# EAGLE schematic MainBoard 10-11 ver2 (EAGLE 5.10)
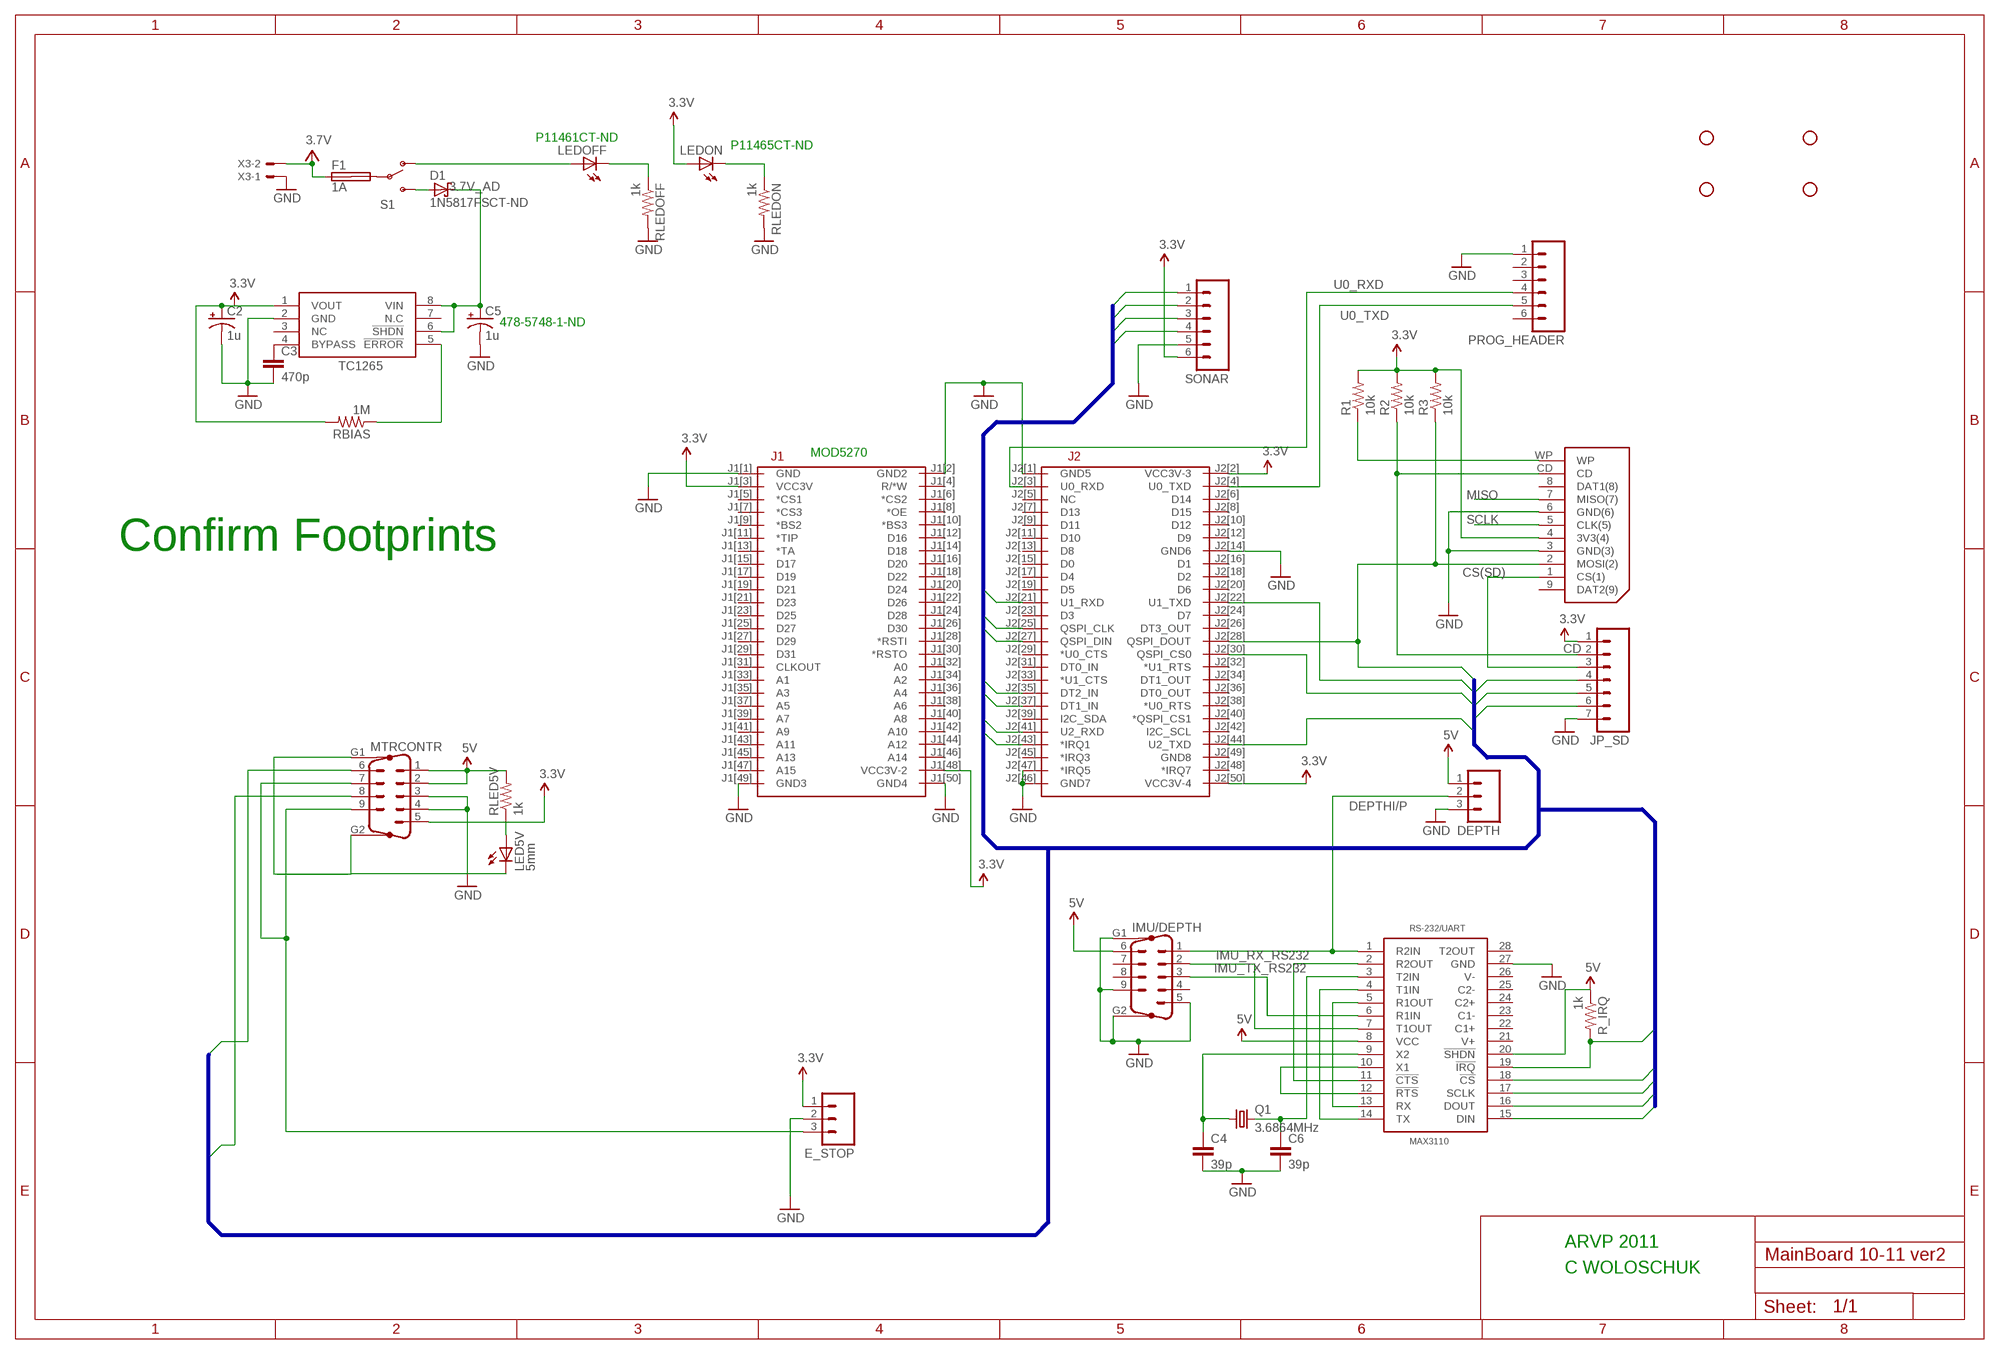
[diagram p0: schematic, sheet 1]

## Parts
C2  1u  CAP_POL1206  [EIA3216]
C3  470p  C-EUC1206  [C1206]
C4  39p  C-EUC1206  [C1206]
C5  1u  CAP_POL1206  [EIA3216]
C6  39p  C-EUC1206  [C1206]
D1  1N5817FSCT-ND  1N5817-B  [DO41-7.6]
DEPTH  M03POLAR  [MOLEX-1X3]
E_STOP  M03POLAR  [MOLEX-1X3]
F1  1A  SHK20L  [SHK20L]
IMU/DEPTH  M09HP  [M09HP]
JP2  STAND-OFF  [STAND-OFF]
JP3  STAND-OFF  [STAND-OFF]
JP4  STAND-OFF  [STAND-OFF]
JP5  STAND-OFF  [STAND-OFF]
JP_SD  M07LOCK  [1X07_LOCK]
LED5V  5mm  LED5MM  [LED5MM]
LEDOFF  LEDCHIP-LED0603  [CHIP-LED0603]
LEDON  LEDCHIP-LED0603  [CHIP-LED0603]
MAX3110  MAX3110  [SO28L]
MOD5270  MOD5270  [MOD5270]
MTRCONTR  M09HP  [M09HP]
PROG_HEADER  M06LOCK_LONGPADS  [1X06_LOCK_LONGPADS]
Q1  3.6864MHz  CRYSTALSM49  [SM49]
R1  10k  RESISTOR1206  [1206]
R2  10k  RESISTOR1206  [1206]
R3  10k  RESISTOR1206  [1206]
R_IRQ  1k  RESISTOR1206  [1206]
RBIAS  1M  RESISTOR1206  [1206]
RLED5V  1k  RESISTOR1206  [1206]
RLEDOFF  1k  RESISTOR1206  [1206]
RLEDON  1k  RESISTOR1206  [1206]
S1  SWITCH-SPST  [SWITCH-3PIN-5.47]
SONAR  M06POLAR  [MOLEX-1X6]
TC1265  TC1265  [SO-08]
U$2  SD_CARD  [SD_CARD]
X3  KK-156-2  [KK-156-2]

## Nets
3.3V: C2.A(+) E_STOP.1 JP_SD.1 LEDON.A MOD5270.J1[3](VCC3V) MOD5270.J1[48](VCC3V-2) MOD5270.J2[2](VCC3V-3) MOD5270.J2[50](VCC3V-4) MTRCONTR.5 R1.2 R2.2 R3.2 RBIAS.2 SONAR.6 TC1265.1(VOUT) U$2.4(3V3(4))
3.7V: F1.1A X3.2
3.7V_AD: C5.A(+) D1.C TC1265.6(!SHDN) TC1265.8(VIN)
5V: DEPTH.1 IMU/DEPTH.6 MAX3110.8(VCC) MAX3110.20(!SHDN) MTRCONTR.1 MTRCONTR.2 R_IRQ.1 RLED5V.2
CD: JP_SD.2 R2.1 U$2.CD
CS(ADC): MOD5270.J2[37](DT1_IN) SONAR.1
CS(MAX3110): MAX3110.18(!CS) MOD5270.J2[30](QSPI_CS0)
CS(SD): JP_SD.3 MOD5270.J2[35](DT2_IN) U$2.1(CS(1))
DEPTHI/P: DEPTH.2 IMU/DEPTH.1 MAX3110.1(R2IN)
GND: C2.C(-) C3.2 C4.2 C5.C(-) C6.2 DEPTH.3 E_STOP.2 IMU/DEPTH.5 IMU/DEPTH.9 IMU/DEPTH.G1 IMU/DEPTH.G2 JP_SD.7 LED5V.K(C) MAX3110.27(GND) MOD5270.J1[1](GND) MOD5270.J1[2](GND2) MOD5270.J1[49](GND3) MOD5270.J1[50](GND4) MOD5270.J2[1](GND5) MOD5270.J2[14](GND6) MTRCONTR.3 MTRCONTR.4 MTRCONTR.G1 MTRCONTR.G2 PROG_HEADER.1 RLEDOFF.2 RLEDON.2 SONAR.5 TC1265.2(GND) U$2.3(GND(3)) U$2.6(GND(6)) X3.1
IMU_RX_RS232: IMU/DEPTH.2 MAX3110.7(T1OUT)
IMU_TX_RS232: IMU/DEPTH.3 MAX3110.6(R1IN)
IRQ1: MAX3110.19(!IRQ) MOD5270.J2[43](*IRQ1) R_IRQ.2
MISO: JP_SD.6 MAX3110.16(DOUT) MOD5270.J2[27](QSPI_DIN) SONAR.3 U$2.7(MISO(7))
MOSI: JP_SD.4 MAX3110.15(DIN) MOD5270.J2[28](QSPI_DOUT) R3.1 SONAR.2 U$2.2(MOSI(2))
N$1: F1.2A S1.P$2(P)
N$2: MAX3110.4(T1IN) MAX3110.14(TX)
N$3: MOD5270.J2[46](GND7) MOD5270.J2[47](*IRQ5) ; supply symbol labelled GND
N$4: R1.1 U$2.WP
N$5: D1.A S1.P$3(S)
N$6: MAX3110.3(T2IN) MAX3110.12(!RTS)
N$7: MAX3110.5(R1OUT) MAX3110.13(RX)
N$8: LEDON.C RLEDON.1
N$9: MAX3110.2(R2OUT) MAX3110.11(!CTS)
N$10: C3.1 TC1265.4(BYPASS)
N$11: LEDOFF.C RLEDOFF.1
N$13: LEDOFF.A S1.P$1(O)
N$14: C6.1 MAX3110.10(X1) Q1.2
N$15: LED5V.A RLED5V.1
N$16: RBIAS.1 TC1265.5(!ERROR)
N$17: C4.1 MAX3110.9(X2) Q1.1
S2-1-ES: E_STOP.3 MTRCONTR.7 MTRCONTR.9
SCLK: JP_SD.5 MAX3110.17(SCLK) MOD5270.J2[25](QSPI_CLK) SONAR.4 U$2.5(CLK(5))
U0_RXD: MOD5270.J2[3](U0_RXD) PROG_HEADER.4
U0_TXD: MOD5270.J2[4](U0_TXD) PROG_HEADER.5
U1_MCRX: MOD5270.J2[21](U1_RXD)
U1_MCTX: MOD5270.J2[22](U1_TXD) MTRCONTR.6
U2_MCRX: MOD5270.J2[41](U2_RXD)
U2_MCTX: MOD5270.J2[44](U2_TXD) MTRCONTR.8
Unconnected: F1.1B F1.2B IMU/DEPTH.4 IMU/DEPTH.7 IMU/DEPTH.8 MAX3110.21(V+) MAX3110.22(C1+) MAX3110.23(C1-) MAX3110.24(C2+) MAX3110.25(C2-) MAX3110.26(V-) MAX3110.28(T2OUT) MOD5270.J1[4](R/*W) MOD5270.J1[5](*CS1) MOD5270.J1[6](*CS2) MOD5270.J1[7](*CS3) MOD5270.J1[8](*OE) MOD5270.J1[9](*BS2) MOD5270.J1[10](*BS3) MOD5270.J1[11](*TIP) MOD5270.J1[12](D16) MOD5270.J1[13](*TA) MOD5270.J1[14](D18) MOD5270.J1[15](D17) MOD5270.J1[16](D20) MOD5270.J1[17](D19) MOD5270.J1[18](D22) MOD5270.J1[19](D21) MOD5270.J1[20](D24) MOD5270.J1[21](D23) MOD5270.J1[22](D26) MOD5270.J1[23](D25) MOD5270.J1[24](D28) MOD5270.J1[25](D27) MOD5270.J1[26](D30) MOD5270.J1[27](D29) MOD5270.J1[28](*RSTI) MOD5270.J1[29](D31) MOD5270.J1[30](*RSTO) MOD5270.J1[31](CLKOUT) MOD5270.J1[32](A0) MOD5270.J1[33](A1) MOD5270.J1[34](A2) MOD5270.J1[35](A3) MOD5270.J1[36](A4) MOD5270.J1[37](A5) MOD5270.J1[38](A6) MOD5270.J1[39](A7) MOD5270.J1[40](A8) MOD5270.J1[41](A9) MOD5270.J1[42](A10) MOD5270.J1[43](A11) MOD5270.J1[44](A12) MOD5270.J1[45](A13) MOD5270.J1[46](A14) MOD5270.J1[47](A15) MOD5270.J2[5](NC) MOD5270.J2[6](D14) MOD5270.J2[7](D13) MOD5270.J2[8](D15) MOD5270.J2[9](D11) MOD5270.J2[10](D12) MOD5270.J2[11](D10) MOD5270.J2[12](D9) MOD5270.J2[13](D8) MOD5270.J2[15](D0) MOD5270.J2[16](D1) MOD5270.J2[17](D4) MOD5270.J2[18](D2) MOD5270.J2[19](D5) MOD5270.J2[20](D6) MOD5270.J2[23](D3) MOD5270.J2[24](D7) MOD5270.J2[26](DT3_OUT) MOD5270.J2[29](*U0_CTS) MOD5270.J2[31](DT0_IN) MOD5270.J2[32](*U1_RTS) MOD5270.J2[33](*U1_CTS) MOD5270.J2[34](DT1_OUT) MOD5270.J2[36](DT0_OUT) MOD5270.J2[38](*U0_RTS) MOD5270.J2[39](I2C_SDA) MOD5270.J2[40](*QSPI_CS1) MOD5270.J2[42](I2C_SCL) MOD5270.J2[45](*IRQ3) MOD5270.J2[48](*IRQ7) MOD5270.J2[49](GND8) PROG_HEADER.2 PROG_HEADER.3 PROG_HEADER.6 TC1265.3(NC) TC1265.7(N.C) U$2.8(DAT1(8)) U$2.9(DAT2(9))

## Buses
U1_MCRX,U2_MCRX,SCLK,MISO,MOSI,CS(SD),CS(ADC),IRQ1,U1_MCTX,U2_MCTX,CS(MAX3110)

## Notes on the sheet
- P11461CT-ND
- P11465CT-ND
- 478-5748-1-ND
- MOD5270
- Confirm Footprints
- ARVP 2011
- C WOLOSCHUK

## Library data of the parts
C2 C5 = SparkFun:CAP_POL: Capacitor Polarized These are standard SMD and PTH capacitors. Normally 10uF, 47uF, and 100uF in electrolytic and tantalum varieties. Always verify the external diameter of the through hole cap, it varies with capacity, voltage, and manufacturer. The EIA devices should be standard.
C3 C4 C6 = rcl:C-EU: CAPACITOR, European symbol
D1 = diode:1N581*: 1.0A SCHOTTKY BARRIER RECTIFIER Source: http://www.diodes.com/datasheets/ds23001.pdf
DEPTH E_STOP = SparkFun:M03: Header 3 Standard 3-pin 0.1" header. Use with straight break away headers (SKU : PRT-00116), right angle break away headers (PRT-00553), swiss pins (PRT-00743), machine pins (PRT-00117), and female headers (PRT-00115). Molex polarized connector foot print use with SKU : PRT-08232 with associated crimp pins and housings.
F1 = fuse:SHK20L: FUSE HOLDER 5 x 20 mm, SH contact, SHH1 Schukat, E1073 Buerklin
IMU/DEPTH MTRCONTR = con-subd:M09HP: SUB-D
JP2-JP5 = SparkFun:STAND-OFF: Stand Off This is the mechanical footprint for a #4 phillips button head screw. Use the keepout ring to avoid running the screw head into surrounding components. SKU : PRT-00447
JP_SD = SparkFun:M07: Header 7 Standard 7-pin 0.1" header. Use with straight break away headers (SKU : PRT-00116), right angle break away headers (PRT-00553), swiss pins (PRT-00743), machine pins (PRT-00117), and female headers (PRT-00115). NOTES ON THE VARIANTS LOCK and LOCK_LONGPADS... This footprint was designed to help hold the alignment of a through-hole component (i.e. 7-pin header) while soldering it into place. You may notice that each hole has been shifted either up or down by 0.005 of an inch from it's more standard position (which is usually a perfectly straight line). This slight alteration caused the pins (the squares in the middle) to touch the edges of the holes. Because they are alternating, it causes a "brace" to hold the header in place. 0.005 has proven to be the perfect amount of "off-center" position when using our standard breakaway headers. Although looks a little odd when you look at the bare footprint, once you have a header in there, the alteration is very hard to notice. Also, if you push a header all the way into place, it is covered up entirely on the bottom side. This idea of altering the position of holes to aid alignment will be further integrated into the Sparkfun Library for other footprints. It can help hold any component with 3 or more connection pins.
LED5V = SparkFun:LED: LEDs Standard schematic elements and footprints for 5mm, 3mm, 1206, and 0603 sized LEDs. 5mm - Spark Fun Electronics SKU : COM-00529 (and others)
LEDOFF LEDON = led:LED: LED OSRAM: - CHIPLED LG R971, LG N971, LY N971, LG Q971, LY Q971, LO R971, LY R971 LH N974, LH R974 LS Q976, LO Q976, LY Q976 LO Q996 - Hyper CHIPLED LW Q18S LB Q993, LB Q99A, LB R99A - SideLED LS A670, LO A670, LY A670, LG A670, LP A670 LB A673, LV A673, LT A673, LW A673 LH A674 LY A675 LS A676, LA A676, LO A676, LY A676, LW A676 LS A679, LY A679, LG A679 - Hyper Micro SIDELED® LS Y876, LA Y876, LO Y876, LY Y876 LT Y87S - SmartLED LW L88C, LW L88S LB L89C, LB L89S, LG L890 LS L89K, LO L89K, LY L89K LS L896, LA L896, LO L896, LY L896 - TOPLED LS T670, LO T670, LY T670, LG T670, LP T670 LSG T670, LSP T670, LSY T670, LOP T670, LYG T670 LG T671, LOG T671, LSG T671 LB T673, LV T673, LT T673, LW T673 LH T674 LS T676, LA T676, LO T676, LY T676, LB T676, LH T676, LSB T676, LW T676 LB T67C, LV T67C, LT T67C, LS T67K, LO T67K, LY T67K, LW E67C LS E67B, LA E67B, LO E67B, LY E67B, LB E67C, LV E67C, LT E67C LW T67C LS T679, LY T679, LG T679 LS T770, LO T770, LY T770, LG T770, LP T770 LB T773, LV T773, LT T773, LW T773 LH T774 LS E675, LA E675, LY E675, LS T675 LS T776, LA T776, LO T776, LY T776, LB T776 LHGB T686 LT T68C, LB T68C - Hyper Mini TOPLED® LB M676 - Mini TOPLED Santana® LG M470 LS M47K, LO M47K, LY M47K Source: http://www.osram.convergy.de LUXEON: - LUMILED® LXK2-PW12-R00, LXK2-PW12-S00, LXK2-PW14-U00, LXK2-PW14-V00 LXK2-PM12-R00, LXK2-PM12-S00, LXK2-PM14-U00 LXK2-PE12-Q00, LXK2-PE12-R00, LXK2-PE12-S00, LXK2-PE14-T00, LXK2-PE14-U00 LXK2-PB12-K00, LXK2-PB12-L00, LXK2-PB12-M00, LXK2-PB14-N00, LXK2-PB14-P00, LXK2-PB14-Q00 LXK2-PR12-L00, LXK2-PR12-M00, LXK2-PR14-Q00, LXK2-PR14-R00 LXK2-PD12-Q00, LXK2-PD12-R00, LXK2-PD12-S00 LXK2-PH12-R00, LXK2-PH12-S00 LXK2-PL12-P00, LXK2-PL12-Q00, LXK2-PL12-R00 Source: www.luxeon.com KINGBRIGHT: KA-3528ASYC Source: www.kingbright.com
MAX3110 = ARVP:MAX3110
MOD5270 = ARVP:MOD5270: Coldfire MOD5270 Microcontroller footprint
PROG_HEADER SONAR = SparkFun:M06: Header 6 Standard 6-pin 0.1" header. Use with straight break away headers (SKU : PRT-00116), right angle break away headers (PRT-00553), swiss pins (PRT-00743), machine pins (PRT-00117), and female headers (PRT-00115). Molex polarized connector foot print use with SKU : PRT-08094 with associated crimp pins and housings. NOTES ON THE VARIANTS LOCK and LOCK_LONGPADS... This footprint was designed to help hold the alignment of a through-hole component (i.e. 6-pin header) while soldering it into place. You may notice that each hole has been shifted either up or down by 0.005 of an inch from it's more standard position (which is a perfectly straight line). This slight alteration caused the pins (the squares in the middle) to touch the edges of the holes. Because they are alternating, it causes a "brace" to hold the component in place. 0.005 has proven to be the perfect amount of "off-center" position when using our standard breakaway headers. Although looks a little odd when you look at the bare footprint, once you have a header in there, the alteration is very hard to notice. Also, if you push a header all the way into place, it is covered up entirely on the bottom side. This idea of altering the position of holes to aid alignment will be further integrated into the Sparkfun Library for other footprints. It can help hold any component with 3 or more connection pins.
Q1 = crystal:CRYSTAL: CRYSTAL
R1-R3 R_IRQ RBIAS RLED5V RLEDOFF RLEDON = SparkFun:RESISTOR: Resistor Basic schematic elements and footprints for 0603, 1206, and PTH 1/10th watt (small) resistors.
S1 = ARVP:SWITCH-SPST: SPST Switch Simple slide switch. Spark Fun Electronics SKU : COM-00102
TC1265 = ARVP:TC1265
U$2 = ARVP:SD_CARD
X3 = con-molex:KK-156-2: KK 156 HEADER Source: http://www.molex.com/pdm_docs/sd/026604100_sd.pdf